# Altium schematic sheet 4.7k ohm SCH.schdoc
size 44 x 27 mm
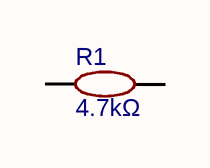
[diagram p0: 4.7k ohm SCH.schdoc]

## Parts
R1  4.7kΩ  [R0402]

## Nets

Not connected (* = marked no-connect by the designer): R1 1 2

## Library data of the parts
R1 = 4.7kΩ: RES 4.7K OHM 1% 1/16W 0402; Manufacturer: YAGEO(国巨); Manufacturer Part: RC0402FR-074K7L; nameAlias: Value; Supplier: LCSC; Supplier Part: C105871; JLCPCB Part Class: Extended Part; spicePre: R; spiceSymbolName: RC0402FR-074K7L; LCSC Part Number: C105871